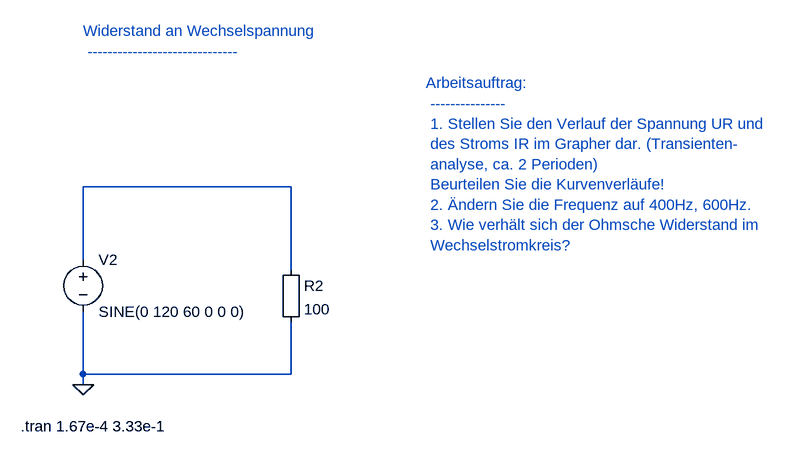
[diagram p0: schematic 11_3_R_an_Wechselspannung.asc]
11_3_R_an_Wechselspannung.asc, the LTspice schematic file:
Version 4
SHEET 1 880 680
WIRE 160 512 160 528
WIRE 160 528 160 608
WIRE 160 432 160 320
WIRE 160 320 480 320
WIRE 480 320 480 448
WIRE 160 608 160 624
WIRE 480 528 480 608
WIRE 480 608 160 608
FLAG 160 624 0
SYMBOL voltage 160 416 R0
SYMATTR InstName V2
SYMATTR Value SINE(0 120 60 0 0 0)
SYMBOL Misc\EuropeanResistor 464 432 R0
SYMATTR InstName R2
SYMATTR Value 100
TEXT 64 688 Left 2 !.tran 1.67e-4 3.33e-1
TEXT 160 80 Left 2 ;Widerstand an Wechselspannung \n ------------------------------
TEXT 688 160 Left 2 ;Arbeitsauftrag: \n --------------- \n 1. Stellen Sie den Verlauf der Spannung UR und \n des Stroms IR im Grapher dar. (Transienten- \n analyse, ca. 2 Perioden) \n Beurteilen Sie die Kurvenverläufe! \n 2. Ändern Sie die Frequenz auf 400Hz, 600Hz. \n 3. Wie verhält sich der Ohmsche Widerstand im \n Wechselstromkreis?

The netlist it stands for:
* 11_3_R_an_Wechselspannung.asc
V2 N001 0 SINE(0 120 60 0 0 0)
R2 N001 0 100
.tran 1.67e-4 3.33e-1
* Widerstand an Wechselspannung
*  ------------------------------
* Arbeitsauftrag:
*  ---------------
*  1. Stellen Sie den Verlauf der Spannung UR und
*  des Stroms IR im Grapher dar. (Transienten-
*  analyse, ca. 2 Perioden)
*  Beurteilen Sie die Kurvenverläufe!
*  2. Ändern Sie die Frequenz auf 400Hz, 600Hz.
*  3. Wie verhält sich der Ohmsche Widerstand im
*  Wechselstromkreis?
.backanno
.end